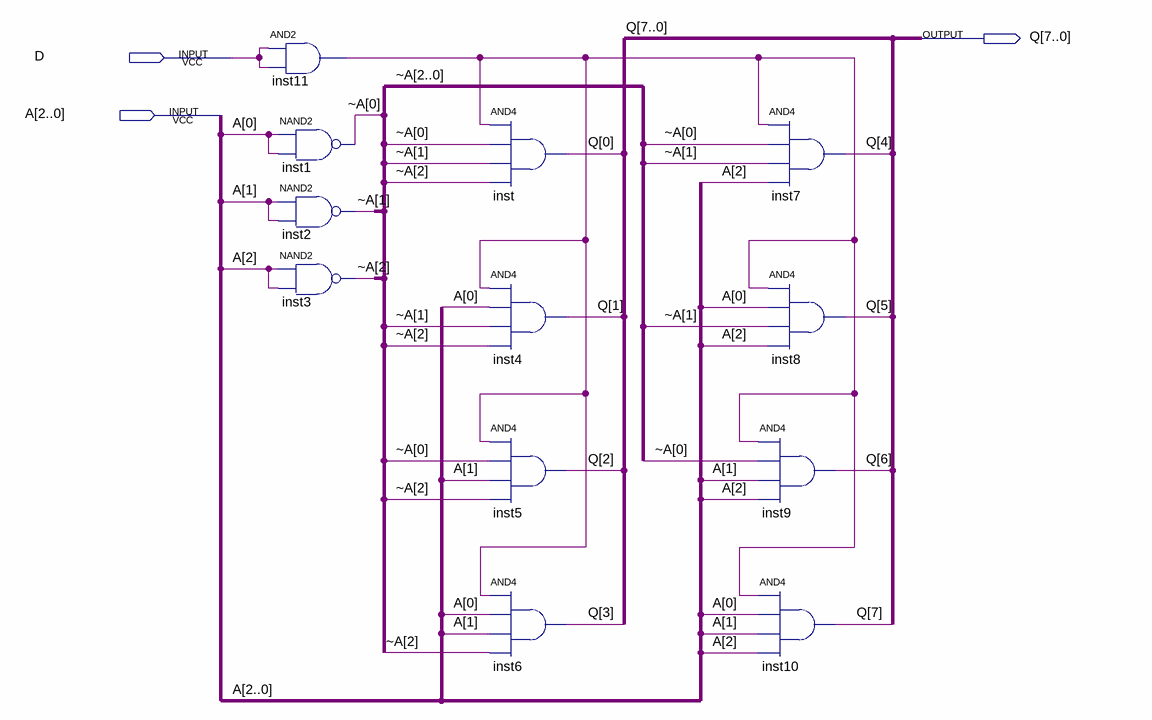
[diagram p0: schematic sheet]
// Quartus schematic DMX1-8.bdf as structural Verilog: 12 symbols, 3 pins
module \DMX1-8  (
  input  D,
  input  [2:0] A,
  output [7:0] Q
);

  wire inst11_out;
  wire [2:0] \~A ;

  and inst11 (inst11_out, D, D);
  nand inst1 (\~A [0], A[0], A[0]);
  nand inst2 (\~A [1], A[1], A[1]);
  nand inst3 (\~A [2], A[2], A[2]);
  and inst (Q[0], inst11_out, \~A [0], \~A [1], \~A [2]);
  and inst4 (Q[1], inst11_out, A[0], \~A [1], \~A [2]);
  and inst5 (Q[2], inst11_out, \~A [0], A[1], \~A [2]);
  and inst6 (Q[3], inst11_out, A[0], A[1], \~A [2]);
  and inst7 (Q[4], inst11_out, \~A [0], \~A [1], A[2]);
  and inst8 (Q[5], inst11_out, A[0], \~A [1], A[2]);
  and inst9 (Q[6], inst11_out, \~A [0], A[1], A[2]);
  and inst10 (Q[7], inst11_out, A[0], A[1], A[2]);
endmodule
